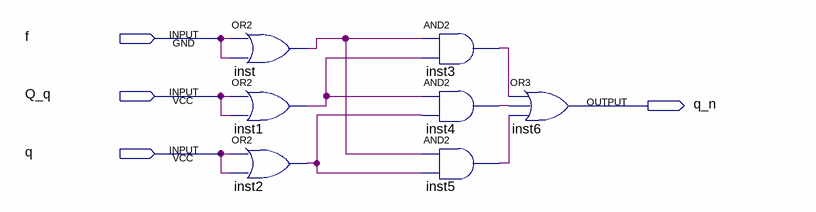
[diagram p0: schematic sheet]
// Quartus schematic sm_q.bdf as structural Verilog: 7 symbols, 4 pins
module sm_q (
  input  f,
  input  Q_q,
  input  q,
  output q_n
);

  wire inst1_out, inst2_out, inst3_out, inst4_out, inst5_out, inst_out;

  or inst (inst_out, f, f);
  or inst1 (inst1_out, Q_q, Q_q);
  or inst2 (inst2_out, q, q);
  and inst3 (inst3_out, inst_out, inst1_out);
  and inst4 (inst4_out, inst1_out, inst2_out);
  and inst5 (inst5_out, inst_out, inst2_out);
  or inst6 (q_n, inst3_out, inst4_out, inst5_out);
endmodule
